# Altium project two_ax_PCB.PrjPcb (part 2 of 2)

## Sheet MotorCell.SchDoc
size A3; SheetNumber: 2
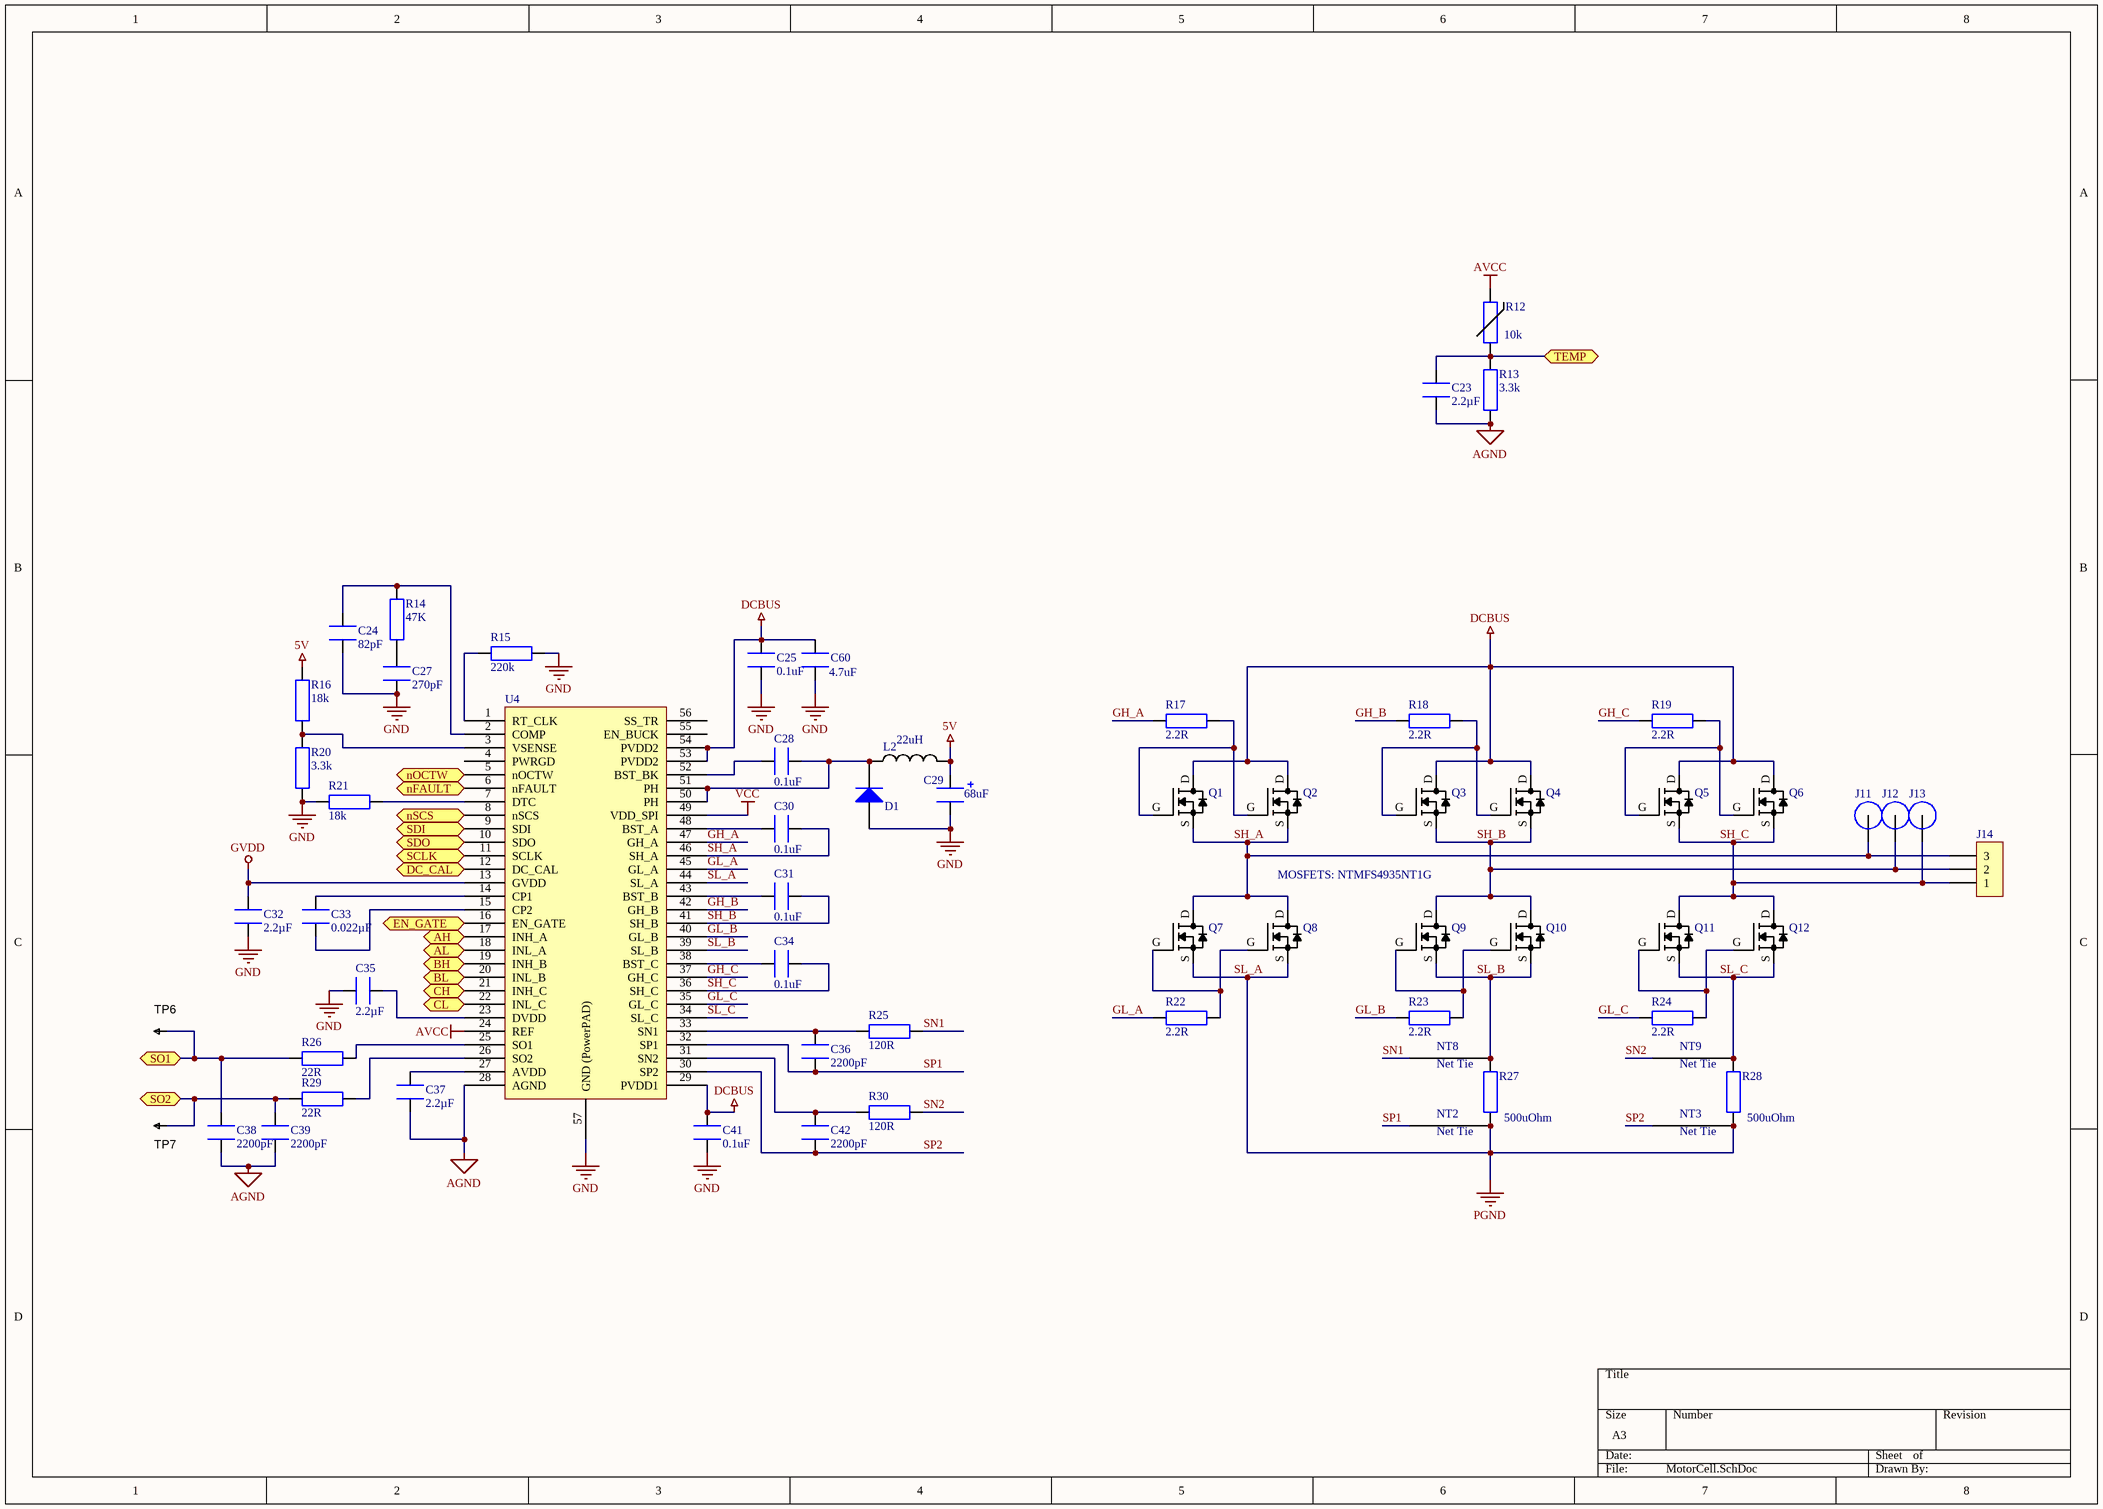
[diagram p1: MotorCell.SchDoc]

### Parts
C23  2.2µF  [CAPC1608X09L]
C24  82pF  [CAPC1608X09L]
C25  0.1uF  [CAPC1608X09L]
C27  270pF  [CAPC1608X09L]
C28  0.1uF  [CAPC1608X09L]
C29  68uF  [CAPCP6032X28N]
C30  0.1uF  [CAPC1608X09L]
C31  0.1uF  [CAPC1608X09L]
C32  2.2µF  [CAPC1608X09L]
C33  0.022µF  [CAPC1608X09L]
C34  0.1uF  [CAPC1608X09L]
C35  2.2µF  [CAPC1608X09L]
C36  2200pF  [CAPC1608X09L]
C37  2.2µF  [CAPC1608X09L]
C38  2200pF  [CAPC1608X09L]
C39  2200pF  [CAPC1608X09L]
C41  0.1uF  [CAPC1608X09L]
C42  2200pF  [CAPC1608X09L]
C60  4.7uF  [CAPC2012X09N]
D1  (no value)  [DIOM2717X10N]
J11  (no value)  [M3 Spade Hole]
J12  (no value)  [M3 Spade Hole]
J13  (no value)  [M3 Spade Hole]
J14  1704936  [1704936]  (value not drawn)
L2  22uH  [INDC6060X28N]
NT2  0.25mm  [NetTie_0.25mm]  (value not drawn)  (net tie, no BOM)
NT3  0.25mm  [NetTie_0.25mm]  (value not drawn)  (net tie, no BOM)
NT8  0.25mm  [NetTie_0.25mm]  (value not drawn)  (net tie, no BOM)
NT9  0.25mm  [NetTie_0.25mm]  (value not drawn)  (net tie, no BOM)
Q1  (no value)  [SO8FL]
Q2  FILL_FOOTPRINT  [SO8FL_FILL]  (value not drawn)
Q3  (no value)  [SO8FL]
Q4  FILL_FOOTPRINT  [SO8FL_FILL]  (value not drawn)
Q5  (no value)  [SO8FL]
Q6  FILL_FOOTPRINT  [SO8FL_FILL]  (value not drawn)
Q7  (no value)  [SO8FL]
Q8  (no value)  [SO8FL]
Q9  (no value)  [SO8FL]
Q10  (no value)  [SO8FL]
Q11  (no value)  [SO8FL]
Q12  (no value)  [SO8FL]
R12  10k  [RESC1005X40N]
R13  3.3k  [RESC1608X55N]
R14  47K  [RESC1608X55N]
R15  220k  [RESC1608X55N]
R16  18k  [RESC1608X55N]
R17  2.2R  [RESC1608X55N]
R18  2.2R  [RESC1608X55N]
R19  2.2R  [RESC1608X55N]
R20  3.3k  [RESC1608X55N]
R21  18k  [RESC1608X55N]
R22  2.2R  [RESC1608X55N]
R23  2.2R  [RESC1608X55N]
R24  2.2R  [RESC1608X55N]
R25  120R  [RESC1608X55N]
R26  22R  [RESC1608X55N]
R27  500uOhm  [RESC6432X09N]
R28  500uOhm  [RESC6432X09N]
R29  22R  [RESC1608X55N]
R30  120R  [RESC1608X55N]
TP6  TESTPOINT  [TP-R30]  (value not drawn)  (no BOM)
TP7  TESTPOINT  [TP-R30]  (value not drawn)  (no BOM)
U4  (no value)  [TSSOP50P810X120_HS-57N]

### Ports
AH, AL, BH, BL, CH, CL, DC_CAL, EN_GATE, nFAULT, nOCTW, nSCS, SCLK, SDI, SDO, SO1, SO2, TEMP

### Nets
5V: C29.1 L2.2 R16.1
AGND: C23.1 C37.1 C38.2 C39.2 R13.2 U4.28(AGND)
AVCC: R12.2 U4.24(REF)
DCBUS: C25.1 C41.1 C60.2 Q1.D Q2.D Q3.D Q4.D Q5.D Q6.D U4.29(PVDD1) U4.53(PVDD2) U4.54(PVDD2)
GND: C24.2 C25.2 C27.2 C29.2 C32.1 C35.1 C41.2 C60.1 D1.A R15.2 R20.2 R21.2 U4.57(GND_(PowerPAD))
GVDD: C32.2 U4.13(GVDD)
PGND: NT2.2 NT3.2 Q7.S Q8.S R27.1 R28.1 U4.44(SL_A)  [also labelled SL_A]
VCC: U4.49(VDD_SPI)
EN_GATE: U4.16(EN_GATE) ; port EN_GATE
GH_A: R17.2 U4.47(GH_A)  [project net GH_A_2]
GH_B: R18.2 U4.42(GH_B)  [project net GH_B_2]
GH_C: R19.2 U4.37(GH_C)  [project net GH_C_2]
GL_A: R22.2 U4.45(GL_A)  [project net GL_A_2]
GL_B: R23.2 U4.40(GL_B)  [project net GL_B_2]
GL_C: R24.2 U4.35(GL_C)  [project net GL_C_2]
M0_AH: U4.17(INH_A) ; port AH
M0_AL: U4.18(INL_A) ; port AL
M0_BH: U4.19(INH_B) ; port BH
M0_BL: U4.20(INL_B) ; port BL
M0_CH: U4.21(INH_C) ; port CH
M0_CL: U4.22(INL_C) ; port CL
M0_nCS: U4.8(nSCS) ; port nSCS
M0_SO1: C38.1 R26.2 TP6.1 ; port SO1
M0_SO2: C39.1 R29.2 TP7.1 ; port SO2
M0_TEMP: C23.2 R12.1 R13.1 ; port TEMP
nFAULT: U4.6(nFAULT) ; port nFAULT
SH_A: C30.1 J11.1 J14.3 Q1.S Q2.S Q7.D Q8.D U4.46(SH_A)  [project net SH_A_2]
SH_B: C31.1 J12.1 J14.2 Q3.S Q4.S Q9.D Q10.D U4.41(SH_B)  [project net SH_B_2]
SH_C: C34.1 J13.1 J14.1 Q5.S Q6.S Q11.D Q12.D U4.36(SH_C)  [project net SH_C_2]
SL_B: NT8.2 Q9.S Q10.S R27.2 U4.39(SL_B)  [project net SL_B_2]
SL_C: NT9.2 Q11.S Q12.S R28.2 U4.34(SL_C)  [project net SL_C_2]
SN1: NT8.1 R25.1  [project net SN1_2]
SN2: NT9.1 R30.1  [project net SN2_2]
SP1: C36.2 NT2.1 U4.32(SP1)  [project net SP1_2]
SP2: C42.2 NT3.1 U4.30(SP2)  [project net SP2_2]
SPI_MISO: U4.10(SDO) ; port SDO
SPI_MOSI: U4.9(SDI) ; port SDI
SPI_SCK: U4.11(SCLK) ; port SCLK
NetC24_1: C24.1 R14.1 U4.2(COMP)
NetC27_1: C27.1 R14.2
NetC28_1: C28.1 D1.K L2.1 U4.50(PH) U4.51(PH)
NetC28_2: C28.2 U4.52(BST_BK)
NetC30_2: C30.2 U4.48(BST_A)
NetC31_2: C31.2 U4.43(BST_B)
NetC33_1: C33.1 U4.14(CP1)
NetC33_2: C33.2 U4.15(CP2)
NetC34_2: C34.2 U4.38(BST_C)
NetC35_2: C35.2 U4.23(DVDD)
NetC36_1: C36.1 R25.2 U4.33(SN1)
NetC37_2: C37.2 U4.27(AVDD)
NetC42_1: C42.1 R30.2 U4.31(SN2)
NetQ1_G: Q1.G Q2.G R17.1
NetQ3_G: Q3.G Q4.G R18.1
NetQ5_G: Q5.G Q6.G R19.1
NetQ7_G: Q7.G Q8.G R22.1
NetQ9_G: Q9.G Q10.G R23.1
NetQ11_G: Q11.G Q12.G R24.1
NetR15_1: R15.1 U4.1(RT_CLK)
NetR16_2: R16.2 R20.1 U4.3(VSENSE)
NetR21_1: R21.1 U4.7(DTC)
NetR26_1: R26.1 U4.25(SO1)
NetR29_1: R29.1 U4.26(SO2)
NetU4_5: U4.5(nOCTW) ; port nOCTW
NetU4_12: U4.12(DC_CAL) ; port DC_CAL

Not connected (* = marked no-connect by the designer): U4 4(PWRGD) 55(EN_BUCK) 56(SS_TR)

### Notes on the sheet
- MOSFETS: NTMFS4935NT1G
- (in symbol NetTie_0.25mm) Net Tie

### Library data of the parts
C23 C32 C35 C37 = GRM188R61C225KE15D: CAP CER 2.2UF 16V X5R 0603; Manufacturer: Murata Electronics North America; Tolerance: ±10%; Supplier 1: Digi-Key; Supplier Part Number 1: 490-3296-1-ND; Manufacturer Part Number: GRM188R61C225KE15D; RoHS: RoHS Compliant; Category: Capacitors; Stock 1: 1255740; Pricing 1: 1=0.12, 10=0.08, 50=0.046, 100=0.038, 250=0.032, 500=0.0268, 1000=0.022 (USD); Packaging: Cut Tape (CT); Capacitance: 2.2µF; Voltage - Rated: 16V; Temperature Coefficient: X5R; Mounting Type: Surface Mount, MLCC; Operating Temperature: -55°C ~ 85°C; Applications: General Purpose; Ratings: -; Package / Case: 0603 (1608 Metric); Size / Dimension: 0.063" L x 0.031" W (1.60mm x 0.80mm); Height - Seated (Max): -; Thickness (Max): 0.035" (0.90mm); Lead Spacing: -; Features: -; Lead Style: -; ComponentLink1URL: http://www.murata.com/~/media/webrenewal/support/library/catalog/products/capacitor/mlcc/c02e.pdf; ComponentLink1Description: http://www.murata.com/~/media/webrenewal/support/library/catalog/products/capacitor/mlcc/c02e.pdf
C24 = GRM1885C2A820JA01D: CAP CER 82PF 100V NP0 0603; Manufacturer: Murata Electronics North America; Tolerance: ±5%; Temperature Coefficient: C0G, NP0; Supplier 1: Digi-Key; Supplier Part Number 1: 490-1349-1-ND; Manufacturer Part Number: GRM1885C2A820JA01D; RoHS: RoHS Compliant; Category: Capacitors; Stock 1: 58970; Pricing 1: 1=0.1, 10=0.052, 50=0.028, 100=0.0237, 250=0.01936, 500=0.01656, 1000=0.0129 (USD); Packaging: Cut Tape (CT); Capacitance: 82pF; Voltage - Rated: 100V; Mounting Type: Surface Mount, MLCC; Operating Temperature: -55°C ~ 125°C; Applications: General Purpose; Ratings: -; Package / Case: 0603 (1608 Metric); Size / Dimension: 0.063" L x 0.031" W (1.60mm x 0.80mm); Height - Seated (Max): -; Thickness (Max): 0.035" (0.90mm); Lead Spacing: -; Features: -; Lead Style: -; ComponentLink1URL: http://www.murata.com/~/media/webrenewal/support/library/catalog/products/capacitor/mlcc/c02e.pdf; ComponentLink1Description: http://www.murata.com/~/media/webrenewal/support/library/catalog/products/capacitor/mlcc/c02e.pdf
C25 C28 C30 C31 C34 C41 = GRM188R71H104KA93D: CAP CER 0.1UF 50V X7R 0603; Manufacturer: Murata Electronics North America; Tolerance: ±10%; Supplier 1: Digi-Key; Supplier Part Number 1: 490-1519-2-ND; Manufacturer Part Number: GRM188R71H104KA93D; RoHS: RoHS Compliant; Category: Capacitors; Pricing 1: 4000=0.01822, 8000=0.01663, 12000=0.01584 (USD); Packaging: Tape & Reel (TR); Capacitance: 0.1uF; Voltage - Rated: 50V; Temperature Coefficient: X7R; Mounting Type: Surface Mount, MLCC; Operating Temperature: -55°C ~ 125°C; Applications: General Purpose; Ratings: -; Package / Case: 0603 (1608 Metric); Size / Dimension: 0.063" L x 0.032" W (1.60mm x 0.80mm); Height - Seated (Max): -; Thickness (Max): 0.035" (0.90mm); Lead Spacing: -; Features: -; Lead Style: -; ComponentLink1URL: http://www.murata.com/~/media/webrenewal/support/library/catalog/products/capacitor/mlcc/c02e.ashx?la=en-us; ComponentLink1Description: http://www.murata.com/~/media/webrenewal/support/library/catalog/products/capacitor/mlcc/c02e.ashx?la=en-us; Stock: 19812000; Part Status: Active; Supplier 2: Digi-Key; Supplier Part Number 2: 490-1519-1-ND; Pricing 2: 1=0.12, 10=0.084, 100=0.0396, 500=0.02778, 1000=0.023 (USD)
C27 = GRM1885C1H271JA01D: CAP CER 270PF 50V NP0 0603; Manufacturer: Murata Electronics North America; Tolerance: ±5%; Temperature Coefficient: C0G, NP0; Supplier 1: Digi-Key; Supplier Part Number 1: 490-1437-1-ND; Manufacturer Part Number: GRM1885C1H271JA01D; RoHS: RoHS Compliant; Category: Capacitors; Stock 1: 46048; Pricing 1: 1=0.1, 10=0.048, 50=0.026, 100=0.022, 250=0.018, 500=0.0154, 1000=0.012 (USD); Packaging: Cut Tape (CT); Capacitance: 270pF; Voltage - Rated: 50V; Mounting Type: Surface Mount, MLCC; Operating Temperature: -55°C ~ 125°C; Applications: General Purpose; Ratings: -; Package / Case: 0603 (1608 Metric); Size / Dimension: 0.063" L x 0.031" W (1.60mm x 0.80mm); Height - Seated (Max): -; Thickness (Max): 0.035" (0.90mm); Lead Spacing: -; Features: -; Lead Style: -; ComponentLink1URL: http://www.murata.com/~/media/webrenewal/support/library/catalog/products/capacitor/mlcc/c02e.pdf; ComponentLink1Description: http://www.murata.com/~/media/webrenewal/support/library/catalog/products/capacitor/mlcc/c02e.pdf
C29 = T495C686M016ATE250: CAP TANT 68UF 16V 20% 2312 250mOhm; Manufacturer: KEMET; Manufacturer Size Code: C; Type: Molded; Lifetime @ Temp.: 2000 Hrs @ 85°C; Value: 68uF; Supplier 1: Digi-Key; Supplier Part Number 1: 399-10452-1-ND; RoHS: RoHS Compliant; Category: Capacitors; Stock: 39507; Pricing 1: 1=0.98, 10=0.747, 100=0.5345 (USD); Packaging: Cut Tape (CT); Part Status: Active; Tolerance: ±20%; ESR (Equivalent Series Resistance): 250 mOhm; Operating Temperature: -55°C ~ 125°C; Mounting Type: Surface Mount; Package / Case: 2312 (6032 Metric); Size / Dimension: 0.236" L x 0.126" W (6.00mm x 3.20mm); Height - Seated (Max): 0.110" (2.80mm); Lead Spacing: -; Features: General Purpose; Failure Rate: -; ComponentLink1URL: https://search.kemet.com/component-edge/download/datasheet/T495C686M016ATE250.pdf; ComponentLink1Description: https://search.kemet.com/component-edge/download/datasheet/T495C686M016ATE250.pdf; Supplier 2: Digi-Key; Supplier Part Number 2: 399-10452-2-ND; Pricing 2: 500=0.35986, 1000=0.30988, 2500=0.28988, 5000=0.27608 (USD); Manufacturer Part Number: T495C686M016ATE250
C33 = GRM188R71H223KA01D: CAP CER 0.022UF 50V X7R 0603; Manufacturer: Murata Electronics North America; Tolerance: ±10%; Supplier 1: Digi-Key; Supplier Part Number 1: 490-1517-2-ND; Manufacturer Part Number: GRM188R71H223KA01D; RoHS: RoHS Compliant; Category: Capacitors; Pricing 1: 4000=0.01518, 8000=0.01386, 12000=0.0132 (USD); Packaging: Tape & Reel (TR); Capacitance: 0.022µF; Voltage - Rated: 50V; Temperature Coefficient: X7R; Mounting Type: Surface Mount, MLCC; Operating Temperature: -55°C ~ 125°C; Applications: General Purpose; Ratings: -; Package / Case: 0603 (1608 Metric); Size / Dimension: 0.063" L x 0.032" W (1.60mm x 0.80mm); Height - Seated (Max): -; Thickness (Max): 0.035" (0.90mm); Lead Spacing: -; Features: -; Lead Style: -; ComponentLink1URL: http://search.murata.co.jp/Ceramy/image/img/A01X/G101/ENG/GRM188R71H223KA01-01.pdf; ComponentLink1Description: http://search.murata.co.jp/Ceramy/image/img/A01X/G101/ENG/GRM188R71H223KA01-01.pdf; Stock: 608000; Part Status: Active; Supplier 2: Digi-Key; Supplier Part Number 2: 490-1517-1-ND; Pricing 2: 1=0.11, 10=0.083, 100=0.0372, 500=0.02656, 1000=0.02087 (USD)
C36 C38 C39 C42 = GRM1885C1H222JA01D: CAP CER 2200PF 50V NP0 0603; Manufacturer: Murata Electronics North America; Tolerance: ±5%; Temperature Coefficient: C0G, NP0; Supplier 1: Digi-Key; Supplier Part Number 1: 490-1459-1-ND; RoHS: RoHS Compliant; Category: Capacitors; Stock 1: 850589; Pricing 1: 1=0.11, 10=0.08, 25=0.058, 50=0.0434, 100=0.0355, 250=0.02972, 500=0.02536, 1000=0.01992 (USD); Packaging: Cut Tape (CT); Capacitance: 2200pF; Voltage - Rated: 50V; Mounting Type: Surface Mount, MLCC; Operating Temperature: -55°C ~ 125°C; Applications: General Purpose; Ratings: -; Package / Case: 0603 (1608 Metric); Size / Dimension: 0.063" L x 0.031" W (1.60mm x 0.80mm); Height - Seated (Max): -; Thickness (Max): 0.035" (0.90mm); Lead Spacing: -; Features: -; Lead Style: -; ComponentLink1URL: http://www.murata.com/~/media/webrenewal/support/library/catalog/products/capacitor/mlcc/c02e.ashx; ComponentLink1Description: http://www.murata.com/~/media/webrenewal/support/library/catalog/products/capacitor/mlcc/c02e.ashx; Part Status: Active
C60 = GRM219R6YA475KA73D: CAP CER 4.7UF 35V X5R 0805; Manufacturer: Murata Electronics North America; Tolerance: ±10%; Supplier 1: Digi-Key; Supplier Part Number 1: 490-7208-2-ND; RoHS: RoHS Compliant; Category: Capacitors; Pricing 1: 4000=0.05126, 8000=0.0487, 12000=0.04613 (USD); Packaging: Tape & Reel (TR); Part Status: Active; Voltage - Rated: 35V; Temperature Coefficient: X5R; Operating Temperature: -55°C ~ 85°C; Features: Derating Recommended; Ratings: -; Applications: General Purpose; Mounting Type: Surface Mount, MLCC; Package / Case: 0805 (2012 Metric); Size / Dimension: 0.079" L x 0.049" W (2.01mm x 1.25mm); Height - Seated (Max): -; Thickness (Max): 0.037" (0.95mm); Lead Spacing: -; Lead Style: -; ComponentLink1URL: http://www.murata.com/~/media/webrenewal/support/library/catalog/products/capacitor/mlcc/c02e.ashx?la=en-us; ComponentLink1Description: http://www.murata.com/~/media/webrenewal/support/library/catalog/products/capacitor/mlcc/c02e.ashx?la=en-us; Supplier 2: Digi-Key; Supplier Part Number 2: 490-7208-1-ND; Pricing 2: 1=0.26, 10=0.177, 100=0.1002, 500=0.07076, 1000=0.06191 (USD); Value: 4.7uF; Stock: 152000; Manufacturer Part Number: GRM219R6YA475KA73D
D1 = MBR140SFT1G: Rectifier Diode, Single, 40 V, 1 A, SOD-123FL, 2, 550 mV
J11-J13 = M3 Spade Terminal
J14 = 1704936: CONN TERM BLOCK 3POS 7.62MM; Manufacturer: Phoenix Contact; Number of Levels: 1; Positions Per Level: 3; Pitch: 0.300" (7.62mm); Mating Orientation: Horizontal with Board; Current: 30A; Voltage: 300V; Wire Gauge: 10-30 AWG; Wire Termination: Screw - Rising Cage Clamp; Torque - Screw: 0.5-0.6 Nm (4.4-5.3 Lb-In); Screw Thread: M3; Supplier 1: Digi-Key; Supplier Part Number 1: 277-5954-ND; RoHS: RoHS Compliant; Category: Connectors, Interconnects; Stock: 3559; Pricing 1: 1=2.19, 10=2.128, 50=1.989, 100=1.8299, 250=1.69064, 500=1.61108, 1000=1.482 (USD); Packaging: Bulk; Part Status: Active; Mounting Type: Through Hole; Features: Interlocking (Side); Color: Green; Operating Temperature: -; Housing Material: Polyamide (PA), Nylon; Contact Material - Plating: -; Clamp Material - Plating: -; Screw Material - Plating: -; ComponentLink1URL: http://media.digikey.com/PDF/Data%20Sheets/Phoenix%20Contact%20PDFs/1704936.pdf; ComponentLink1Description: http://media.digikey.com/PDF/Data%20Sheets/Phoenix%20Contact%20PDFs/1704936.pdf; Manufacturer Part Number: 1704936
L2 = NR6028T220M: INDUCTOR 22UH 1.4A 175.5 MOHM; Value: 22uH
NT2 NT3 NT8 NT9 = NetTie_0.25mm
Q1-Q12 = NTMFS4935NT1G: MOSFET N-CH 30V 13A SO8FL; Manufacturer: ON Semiconductor; FET Type: N-Channel; Current - Continuous Drain (Id) @ 25°C: 13A (Ta), 93A (Tc); Drive Voltage (Max Rds On,  Min Rds On): 4.5V, 10V; Vgs(th) (Max) @ Id: 2.2V @ 250µA; Gate Charge (Qg) (Max) @ Vgs: 49.4nC @ 10V; Input Capacitance (Ciss) (Max) @ Vds: 4850pF @ 15V; Vgs (Max): ±20V; Power Dissipation (Max): 930mW (Ta), 48W (Tc); Rds On (Max) @ Id, Vgs: 3.2 mOhm @ 30A, 10V; Supplier 1: Digi-Key; Supplier Part Number 1: NTMFS4935NT1GOSCT-ND; RoHS: RoHS Compliant; Category: Discrete Semiconductor Products; Stock 1: 932; Pricing 1: 1=0.61, 10=0.541, 100=0.4145, 500=0.3277 (USD); Packaging: Cut Tape (CT); Part Status: Active; Technology: MOSFET (Metal Oxide); Drain to Source Voltage (Vdss): 30V; FET Feature: -; Operating Temperature: -55°C ~ 150°C (TJ); Mounting Type: Surface Mount; Supplier Device Package: 5-DFN (5x6) (8-SOFL); Package / Case: 8-PowerTDFN, 5 Leads; ComponentLink1URL: http://www.onsemi.com/pub_link/Collateral/NTMFS4935N-D.PDF; ComponentLink1Description: http://www.onsemi.com/pub_link/Collateral/NTMFS4935N-D.PDF; Manufacturer Part Number: NTMFS4935NT1G
R12 = NCP15XH103F03RC: THERMISTOR 10K OHM NTC 0402 SMD; Value: 10k
R13 R20 = RC0603FR-073K3L: RES SMD 3.3K OHM 1% 1/10W 0603; Manufacturer: Yageo; Power (Watts): 0.1W, 1/10W; Temperature Coefficient: ±100ppm/°C; Supplier 1: Digi-Key; Supplier Part Number 1: 311-3.30KHRCT-ND; Manufacturer Part Number: RC0603FR-073K3L; RoHS: RoHS Compliant; Category: Resistors; Stock 1: 420019; Pricing 1: 1=0.1, 10=0.014, 25=0.01, 100=0.0057, 250=0.00436, 500=0.00348, 1000=0.00257, 2500=0.00223 (USD); Packaging: Cut Tape (CT); Resistance (Ohms): 3.3k; Tolerance: ±1%; Composition: Thick Film; Features: Moisture Resistant; Operating Temperature: -55°C ~ 155°C; Package / Case: 0603 (1608 Metric); Supplier Device Package: 0603; Size / Dimension: 0.063" L x 0.031" W (1.60mm x 0.80mm); Height: 0.022" (0.55mm); Number of Terminations: 2; ComponentLink1URL: http://www.yageo.com/documents/recent/PYu-RC_Group_51_RoHS_L_04.pdf; ComponentLink1Description: http://www.yageo.com/documents/recent/PYu-RC_Group_51_RoHS_L_04.pdf
R14 = RC0603FR-0747KL: RES SMD 47K OHM 1% 1/10W 0603; Manufacturer: Yageo; Power (Watts): 0.1W, 1/10W; Temperature Coefficient: ±100ppm/°C; Supplier 1: Digi-Key; Supplier Part Number 1: 311-47.0KHRCT-ND; Manufacturer Part Number: RC0603FR-0747KL; RoHS: RoHS Compliant; Category: Resistors; Stock 1: 930868; Pricing 1: 1=0.1, 10=0.014, 25=0.01, 100=0.0057, 250=0.00436, 500=0.00348, 1000=0.00257, 2500=0.00223 (USD); Packaging: Cut Tape (CT); Resistance (Ohms): 47k; Tolerance: ±1%; Composition: Thick Film; Features: Moisture Resistant; Operating Temperature: -55°C ~ 155°C; Package / Case: 0603 (1608 Metric); Supplier Device Package: 0603; Size / Dimension: 0.063" L x 0.031" W (1.60mm x 0.80mm); Height: 0.022" (0.55mm); Number of Terminations: 2; ComponentLink1URL: http://www.yageo.com/documents/recent/PYu-RC_Group_51_RoHS_L_04.pdf; ComponentLink1Description: http://www.yageo.com/documents/recent/PYu-RC_Group_51_RoHS_L_04.pdf
R15 = RC0603FR-07220KL: RES SMD 220K OHM 1% 1/10W 0603; Manufacturer: Yageo; Power (Watts): 0.1W, 1/10W; Temperature Coefficient: ±100ppm/°C; Supplier 1: Digi-Key; Supplier Part Number 1: 311-220KHRCT-ND; Manufacturer Part Number: RC0603FR-07220KL; RoHS: RoHS Compliant; Category: Resistors; Stock 1: 204390; Pricing 1: 1=0.1, 10=0.014, 25=0.01, 100=0.0057, 250=0.00436, 500=0.00348, 1000=0.00257, 2500=0.00223 (USD); Packaging: Cut Tape (CT); Resistance (Ohms): 220k; Tolerance: ±1%; Composition: Thick Film; Features: Moisture Resistant; Operating Temperature: -55°C ~ 155°C; Package / Case: 0603 (1608 Metric); Supplier Device Package: 0603; Size / Dimension: 0.063" L x 0.031" W (1.60mm x 0.80mm); Height: 0.022" (0.55mm); Number of Terminations: 2; ComponentLink1URL: http://www.yageo.com/documents/recent/PYu-RC_Group_51_RoHS_L_04.pdf; ComponentLink1Description: http://www.yageo.com/documents/recent/PYu-RC_Group_51_RoHS_L_04.pdf
R16 R21 = RC0603FR-0718KL: RES SMD 18K OHM 1% 1/10W 0603; Manufacturer: Yageo; Power (Watts): 0.1W, 1/10W; Temperature Coefficient: ±100ppm/°C; Supplier 1: Digi-Key; Supplier Part Number 1: 311-18.0KHRCT-ND; Manufacturer Part Number: RC0603FR-0718KL; RoHS: RoHS Compliant; Category: Resistors; Stock 1: 0; Pricing 1: 1=0.1, 10=0.014, 25=0.01, 100=0.0057, 250=0.00436, 500=0.00348, 1000=0.00257, 2500=0.00223 (USD); Packaging: Cut Tape (CT); Resistance (Ohms): 18k; Tolerance: ±1%; Composition: Thick Film; Features: Moisture Resistant; Operating Temperature: -55°C ~ 155°C; Package / Case: 0603 (1608 Metric); Supplier Device Package: 0603; Size / Dimension: 0.063" L x 0.031" W (1.60mm x 0.80mm); Height: 0.022" (0.55mm); Number of Terminations: 2; ComponentLink1URL: http://www.yageo.com/documents/recent/PYu-RC_Group_51_RoHS_L_04.pdf; ComponentLink1Description: http://www.yageo.com/documents/recent/PYu-RC_Group_51_RoHS_L_04.pdf
R17-R19 R22-R24 = RC0603FR-072R2L: RES SMD 2.2 OHM 1% 1/10W 0603; Manufacturer: Yageo; Resistance (Ohms): 2.2; Power (Watts): 0.1W, 1/10W; Temperature Coefficient: ±200ppm/°C; Supplier 1: Digi-Key; Supplier Part Number 1: 311-2.2HRCT-ND; Manufacturer Part Number: RC0603FR-072R2L; RoHS: RoHS Compliant; Category: Resistors; Stock 1: 16531; Pricing 1: 1=0.1, 10=0.02, 25=0.0144, 100=0.0082, 250=0.00624, 500=0.00498, 1000=0.00367, 2500=0.00319 (USD); Packaging: Cut Tape (CT); Tolerance: ±1%; Composition: Thick Film; Features: Moisture Resistant; Operating Temperature: -55°C ~ 155°C; Package / Case: 0603 (1608 Metric); Supplier Device Package: 0603; Size / Dimension: 0.063" L x 0.031" W (1.60mm x 0.80mm); Height: 0.022" (0.55mm); Number of Terminations: 2; ComponentLink1URL: http://www.yageo.com/documents/recent/PYu-RC_Group_51_RoHS_L_04.pdf; ComponentLink1Description: http://www.yageo.com/documents/recent/PYu-RC_Group_51_RoHS_L_04.pdf
R25 R30 = RC0603FR-07120RL: RES SMD 120 OHM 1% 1/10W 0603; Manufacturer: Yageo; Resistance (Ohms): 120; Power (Watts): 0.1W, 1/10W; Temperature Coefficient: ±100ppm/°C; Supplier 1: Digi-Key; Supplier Part Number 1: 311-120HRCT-ND; Manufacturer Part Number: RC0603FR-07120RL; RoHS: RoHS Compliant; Category: Resistors; Stock 1: 1545282; Pricing 1: 1=0.1, 10=0.014, 25=0.01, 100=0.0057, 250=0.00436, 500=0.00348, 1000=0.00257, 2500=0.00223 (USD); Packaging: Cut Tape (CT); Tolerance: ±1%; Composition: Thick Film; Features: Moisture Resistant; Operating Temperature: -55°C ~ 155°C; Package / Case: 0603 (1608 Metric); Supplier Device Package: 0603; Size / Dimension: 0.063" L x 0.031" W (1.60mm x 0.80mm); Height: 0.022" (0.55mm); Number of Terminations: 2; ComponentLink1URL: http://www.yageo.com/documents/recent/PYu-RC_Group_51_RoHS_L_04.pdf; ComponentLink1Description: http://www.yageo.com/documents/recent/PYu-RC_Group_51_RoHS_L_04.pdf
R26 R29 = RC0603FR-0722RL: RES SMD 22 OHM 1% 1/10W 0603; Manufacturer: Yageo; Resistance (Ohms): 22; Power (Watts): 0.1W, 1/10W; Temperature Coefficient: ±100ppm/°C; Supplier 1: Digi-Key; Supplier Part Number 1: 311-22.0HRCT-ND; Manufacturer Part Number: RC0603FR-0722RL; RoHS: RoHS Compliant; Category: Resistors; Stock 1: 575303; Pricing 1: 1=0.1, 10=0.014, 25=0.01, 100=0.0057, 250=0.00436, 500=0.00348, 1000=0.00257, 2500=0.00223 (USD); Packaging: Cut Tape (CT); Tolerance: ±1%; Composition: Thick Film; Features: Moisture Resistant; Operating Temperature: -55°C ~ 155°C; Package / Case: 0603 (1608 Metric); Supplier Device Package: 0603; Size / Dimension: 0.063" L x 0.031" W (1.60mm x 0.80mm); Height: 0.022" (0.55mm); Number of Terminations: 2; ComponentLink1URL: http://www.yageo.com/documents/recent/PYu-RC_Group_51_RoHS_L_04.pdf; ComponentLink1Description: http://www.yageo.com/documents/recent/PYu-RC_Group_51_RoHS_L_04.pdf
R27 R28 = CSR2512C0R0005F: RES SMD 0.0005 OHM 1% 3W 2512; Manufacturer: Riedon; Temperature Coefficient: ±100ppm/°C; Value: 500uOhm; Supplier 1: Digi-Key; Supplier Part Number 1: 696-1183-2-ND; RoHS: RoHS Compliant; Category: Resistors; Stock: 2000; Pricing 1: 2000=0.19817, 6000=0.1937, 10000=0.187, 50000=0.18148 (USD); Packaging: Tape & Reel (TR); Part Status: Active; Tolerance: ±1%; Power (Watts): 3W; Composition: Metal Element; Features: Current Sense; Operating Temperature: -55°C ~ 170°C; Package / Case: 2512 (6432 Metric); Supplier Device Package: 2512; Size / Dimension: 0.250" L x 0.118" W (6.35mm x 3.00mm); Height - Seated (Max): 0.057" (1.45mm); Failure Rate: -; ComponentLink1URL: http://riedon.com/media/pdf/CSR.pdf; ComponentLink1Description: http://riedon.com/media/pdf/CSR.pdf; Supplier 2: Digi-Key; Supplier Part Number 2: 696-1183-1-ND; Pricing 2: 1=0.69, 10=0.574, 25=0.4916, 50=0.4426, 100=0.3852, 250=0.3442, 500=0.27864, 1000=0.22536 (USD); Manufacturer Part Number: CSR2512C0R0005F
TP6 TP7 = TESTPOINT: SMD test pin
U4 = DRV8301: MOTOR DRIVER, 3PH, 56HTSSOP

## Sheet MotorCell_noPow.SchDoc
size A3; SheetNumber: 3
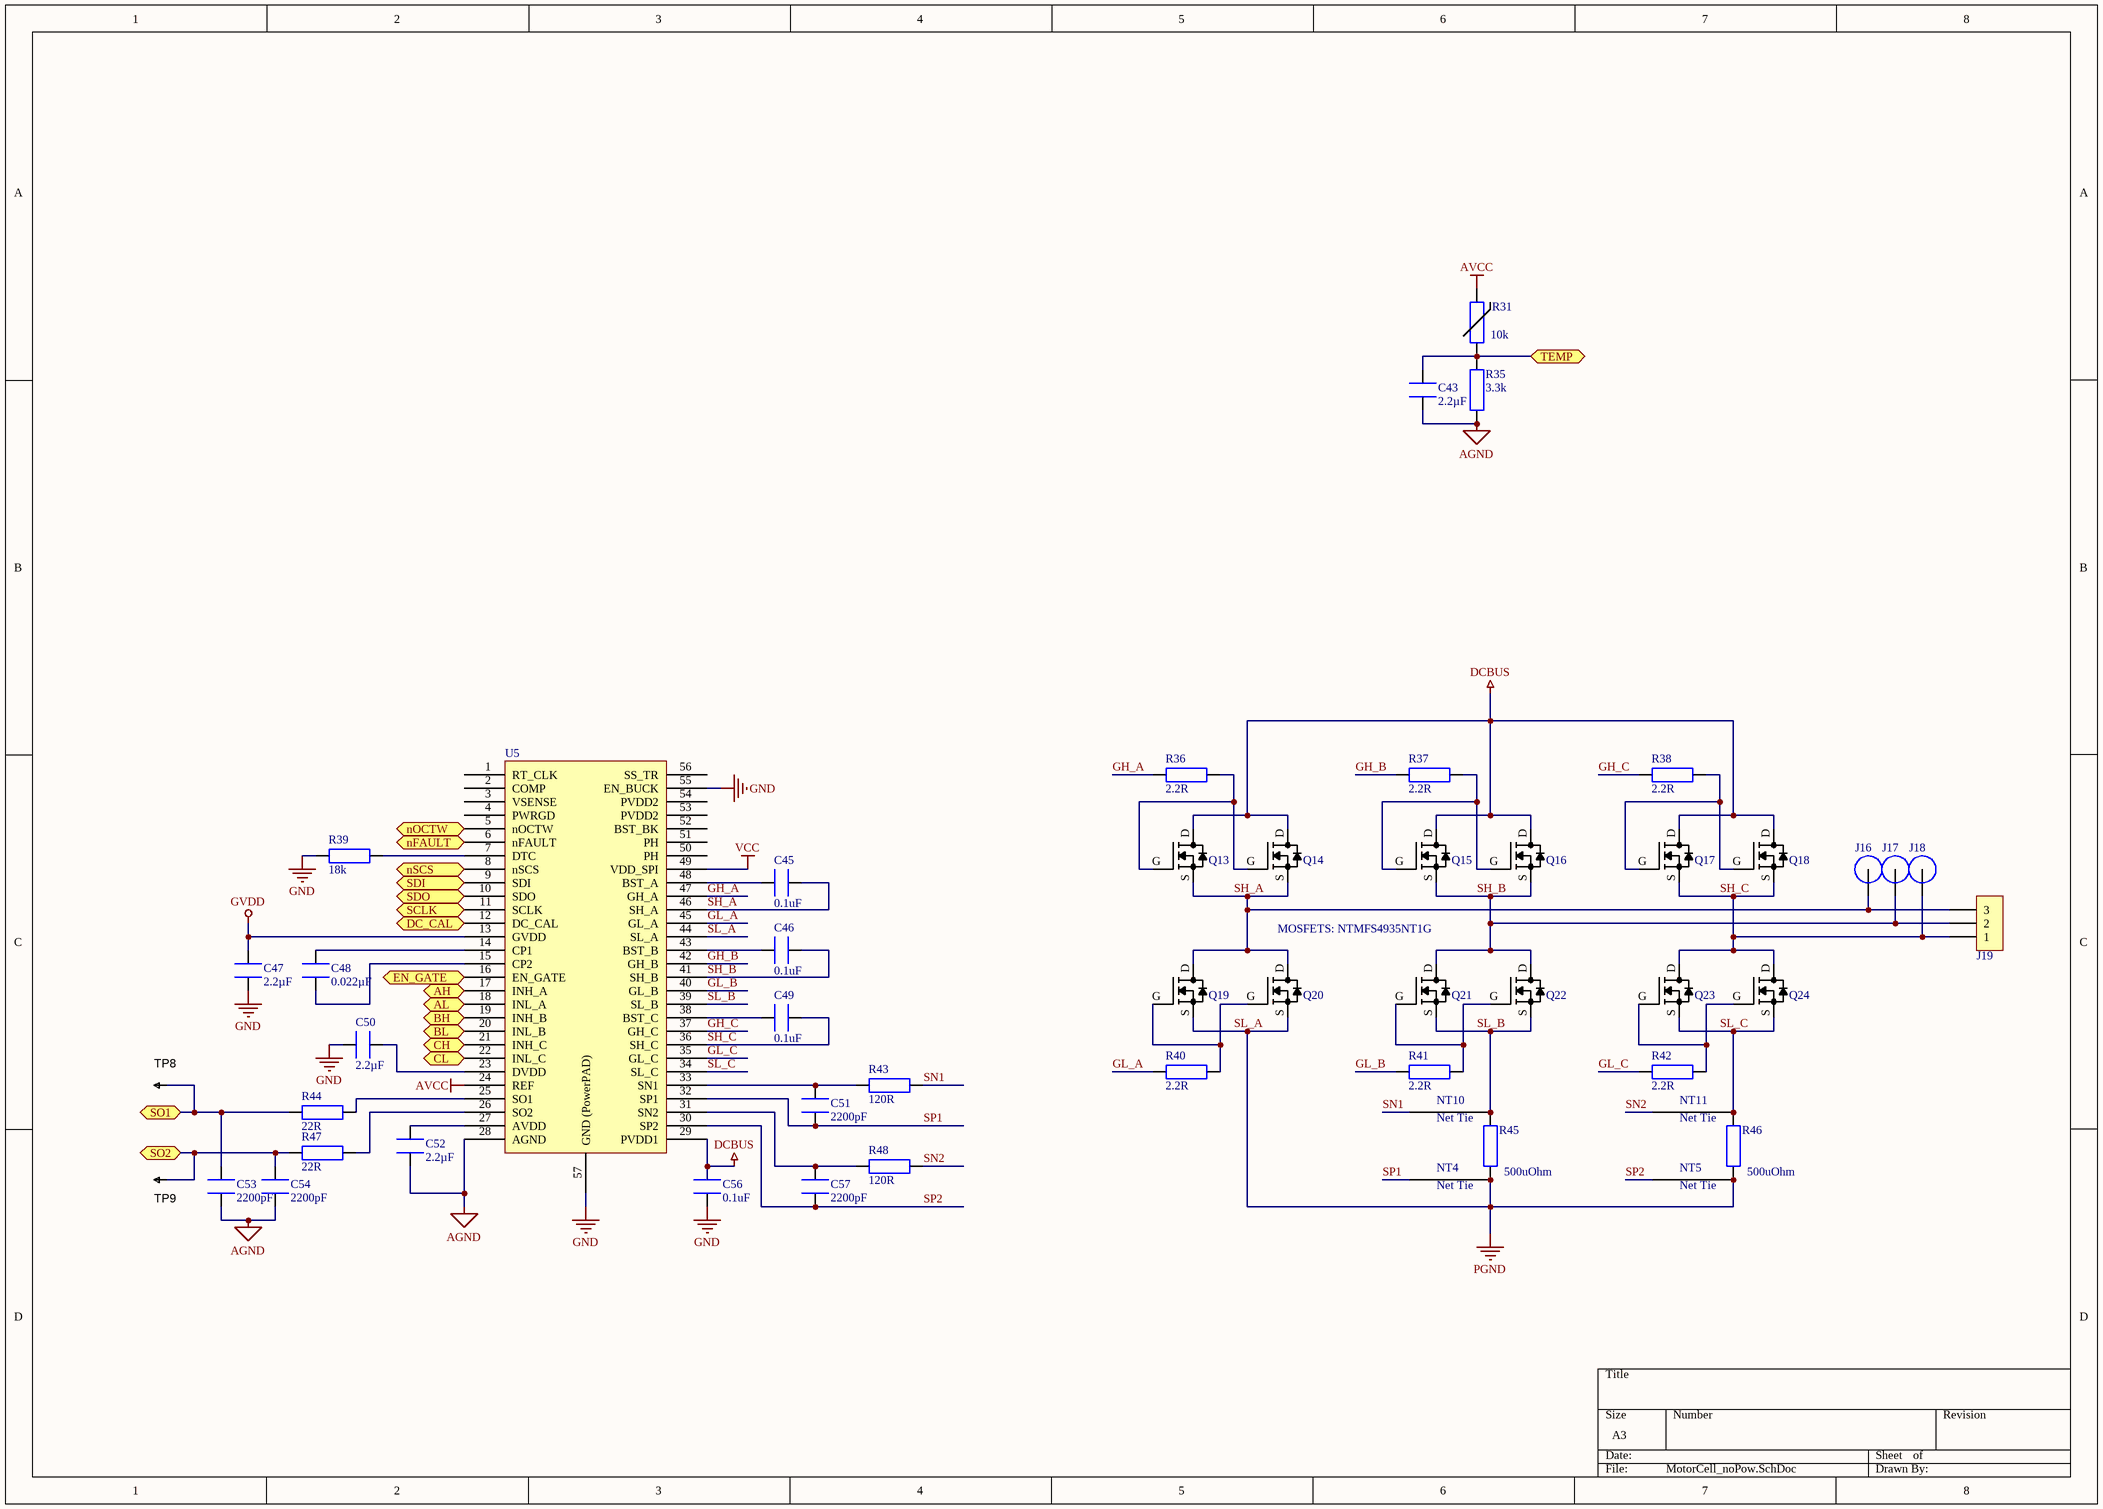
[diagram p2: MotorCell_noPow.SchDoc]

### Parts
C43  2.2µF  [CAPC1608X09L]
C45  0.1uF  [CAPC1608X09L]
C46  0.1uF  [CAPC1608X09L]
C47  2.2µF  [CAPC1608X09L]
C48  0.022µF  [CAPC1608X09L]
C49  0.1uF  [CAPC1608X09L]
C50  2.2µF  [CAPC1608X09L]
C51  2200pF  [CAPC1608X09L]
C52  2.2µF  [CAPC1608X09L]
C53  2200pF  [CAPC1608X09L]
C54  2200pF  [CAPC1608X09L]
C56  0.1uF  [CAPC1608X09L]
C57  2200pF  [CAPC1608X09L]
J16  (no value)  [M3 Spade Hole]
J17  (no value)  [M3 Spade Hole]
J18  (no value)  [M3 Spade Hole]
J19  1704936  [1704936]  (value not drawn)
NT4  0.25mm  [NetTie_0.25mm]  (value not drawn)  (net tie, no BOM)
NT5  0.25mm  [NetTie_0.25mm]  (value not drawn)  (net tie, no BOM)
NT10  0.25mm  [NetTie_0.25mm]  (value not drawn)  (net tie, no BOM)
NT11  0.25mm  [NetTie_0.25mm]  (value not drawn)  (net tie, no BOM)
Q13  (no value)  [SO8FL]
Q14  FILL_FOOTPRINT  [SO8FL_FILL]  (value not drawn)
Q15  (no value)  [SO8FL]
Q16  FILL_FOOTPRINT  [SO8FL_FILL]  (value not drawn)
Q17  (no value)  [SO8FL]
Q18  FILL_FOOTPRINT  [SO8FL_FILL]  (value not drawn)
Q19  (no value)  [SO8FL]
Q20  (no value)  [SO8FL]
Q21  (no value)  [SO8FL]
Q22  (no value)  [SO8FL]
Q23  (no value)  [SO8FL]
Q24  (no value)  [SO8FL]
R31  10k  [RESC1005X40N]
R35  3.3k  [RESC1608X55N]
R36  2.2R  [RESC1608X55N]
R37  2.2R  [RESC1608X55N]
R38  2.2R  [RESC1608X55N]
R39  18k  [RESC1608X55N]
R40  2.2R  [RESC1608X55N]
R41  2.2R  [RESC1608X55N]
R42  2.2R  [RESC1608X55N]
R43  120R  [RESC1608X55N]
R44  22R  [RESC1608X55N]
R45  500uOhm  [RESC6432X09N]
R46  500uOhm  [RESC6432X09N]
R47  22R  [RESC1608X55N]
R48  120R  [RESC1608X55N]
TP8  TESTPOINT  [TP-R30]  (value not drawn)  (no BOM)
TP9  TESTPOINT  [TP-R30]  (value not drawn)  (no BOM)
U5  (no value)  [TSSOP50P810X120_HS-57N]

### Ports
AH, AL, BH, BL, CH, CL, DC_CAL, EN_GATE, nFAULT, nOCTW, nSCS, SCLK, SDI, SDO, SO1, SO2, TEMP

### Nets
AGND: C43.1 C52.1 C53.2 C54.2 R35.2 U5.28(AGND)
AVCC: R31.2 U5.24(REF)
DCBUS: C56.1 Q13.D Q14.D Q15.D Q16.D Q17.D Q18.D U5.29(PVDD1)
GND: C47.1 C50.1 C56.2 R39.2 U5.55(EN_BUCK) U5.57(GND_(PowerPAD))
GVDD: C47.2 U5.13(GVDD)
PGND: NT4.2 NT5.2 Q19.S Q20.S R45.1 R46.1 U5.44(SL_A)  [also labelled SL_A]
VCC: U5.49(VDD_SPI)
EN_GATE: U5.16(EN_GATE) ; port EN_GATE
GH_A: R36.1 U5.47(GH_A)  [project net GH_A_3]
GH_B: R37.1 U5.42(GH_B)  [project net GH_B_3]
GH_C: R38.1 U5.37(GH_C)  [project net GH_C_3]
GL_A: R40.1 U5.45(GL_A)  [project net GL_A_3]
GL_B: R41.1 U5.40(GL_B)  [project net GL_B_3]
GL_C: R42.1 U5.35(GL_C)  [project net GL_C_3]
M1_AH: U5.17(INH_A) ; port AH
M1_AL: U5.18(INL_A) ; port AL
M1_BH: U5.19(INH_B) ; port BH
M1_BL: U5.20(INL_B) ; port BL
M1_CH: U5.21(INH_C) ; port CH
M1_CL: U5.22(INL_C) ; port CL
M1_nCS: U5.8(nSCS) ; port nSCS
M1_SO1: C53.1 R44.2 TP8.1 ; port SO1
M1_SO2: C54.1 R47.2 TP9.1 ; port SO2
M1_TEMP: C43.2 R31.1 R35.1 ; port TEMP
nFAULT: U5.6(nFAULT) ; port nFAULT
SH_A: C45.1 J16.1 J19.3 Q13.S Q14.S Q19.D Q20.D U5.46(SH_A)  [project net SH_A_3]
SH_B: C46.1 J17.1 J19.2 Q15.S Q16.S Q21.D Q22.D U5.41(SH_B)  [project net SH_B_3]
SH_C: C49.1 J18.1 J19.1 Q17.S Q18.S Q23.D Q24.D U5.36(SH_C)  [project net SH_C_3]
SL_B: NT10.2 Q21.S Q22.S R45.2 U5.39(SL_B)  [project net SL_B_3]
SL_C: NT11.2 Q23.S Q24.S R46.2 U5.34(SL_C)  [project net SL_C_3]
SN1: NT10.1 R43.1  [project net SN1_3]
SN2: NT11.1 R48.1  [project net SN2_3]
SP1: C51.2 NT4.1 U5.32(SP1)  [project net SP1_3]
SP2: C57.2 NT5.1 U5.30(SP2)  [project net SP2_3]
SPI_MISO: U5.10(SDO) ; port SDO
SPI_MOSI: U5.9(SDI) ; port SDI
SPI_SCK: U5.11(SCLK) ; port SCLK
NetC45_2: C45.2 U5.48(BST_A)
NetC46_2: C46.2 U5.43(BST_B)
NetC48_1: C48.1 U5.14(CP1)
NetC48_2: C48.2 U5.15(CP2)
NetC49_2: C49.2 U5.38(BST_C)
NetC50_2: C50.2 U5.23(DVDD)
NetC51_1: C51.1 R43.2 U5.33(SN1)
NetC52_2: C52.2 U5.27(AVDD)
NetC57_1: C57.1 R48.2 U5.31(SN2)
NetQ13_G: Q13.G Q14.G R36.2
NetQ15_G: Q15.G Q16.G R37.2
NetQ17_G: Q17.G Q18.G R38.2
NetQ19_G: Q19.G Q20.G R40.2
NetQ21_G: Q21.G Q22.G R41.2
NetQ23_G: Q23.G Q24.G R42.2
NetR39_1: R39.1 U5.7(DTC)
NetR44_1: R44.1 U5.25(SO1)
NetR47_1: R47.1 U5.26(SO2)
NetU5_5: U5.5(nOCTW) ; port nOCTW
NetU5_12: U5.12(DC_CAL) ; port DC_CAL

Not connected (* = marked no-connect by the designer): U5 1(RT_CLK) 2(COMP) 3(VSENSE) 4(PWRGD) 50(PH) 51(PH) 52(BST_BK) 53(PVDD2) 54(PVDD2) 56(SS_TR)

### Notes on the sheet
- MOSFETS: NTMFS4935NT1G
- (in symbol NetTie_0.25mm) Net Tie

### Library data of the parts
C43 C47 C50 C52 = GRM188R61C225KE15D: as C23 on sheet MotorCell; Supplier 1: Digi-Key; Supplier Part Number 1: 490-3296-1-ND; Manufacturer Part Number: GRM188R61C225KE15D; RoHS: RoHS Compliant; Category: Capacitors; Stock 1: 1255740; Pricing 1: 1=0.12, 10=0.08, 50=0.046, 100=0.038, 250=0.032, 500=0.0268, 1000=0.022 (USD); Packaging: Cut Tape (CT); Capacitance: 2.2µF; Voltage - Rated: 16V; Temperature Coefficient: X5R; Mounting Type: Surface Mount, MLCC; Operating Temperature: -55°C ~ 85°C; Applications: General Purpose; Ratings: -; Package / Case: 0603 (1608 Metric); Size / Dimension: 0.063" L x 0.031" W (1.60mm x 0.80mm); Height - Seated (Max): -; Thickness (Max): 0.035" (0.90mm); Lead Spacing: -; Features: -; Lead Style: -; ComponentLink1URL: http://www.murata.com/~/media/webrenewal/support/library/catalog/products/capacitor/mlcc/c02e.pdf; ComponentLink1Description: http://www.murata.com/~/media/webrenewal/support/library/catalog/products/capacitor/mlcc/c02e.pdf
C45 C46 C49 C56 = GRM188R71H104KA93D: as C25 on sheet MotorCell; Supplier 1: Digi-Key; Supplier Part Number 1: 490-1519-2-ND; Manufacturer Part Number: GRM188R71H104KA93D; RoHS: RoHS Compliant; Category: Capacitors; Pricing 1: 4000=0.01822, 8000=0.01663, 12000=0.01584 (USD); Packaging: Tape & Reel (TR); Capacitance: 0.1uF; Voltage - Rated: 50V; Temperature Coefficient: X7R; Mounting Type: Surface Mount, MLCC; Operating Temperature: -55°C ~ 125°C; Applications: General Purpose; Ratings: -; Package / Case: 0603 (1608 Metric); Size / Dimension: 0.063" L x 0.032" W (1.60mm x 0.80mm); Height - Seated (Max): -; Thickness (Max): 0.035" (0.90mm); Lead Spacing: -; Features: -; Lead Style: -; ComponentLink1URL: http://www.murata.com/~/media/webrenewal/support/library/catalog/products/capacitor/mlcc/c02e.ashx?la=en-us; ComponentLink1Description: http://www.murata.com/~/media/webrenewal/support/library/catalog/products/capacitor/mlcc/c02e.ashx?la=en-us; Stock: 19812000; Part Status: Active; Supplier 2: Digi-Key; Supplier Part Number 2: 490-1519-1-ND; Pricing 2: 1=0.12, 10=0.084, 100=0.0396, 500=0.02778, 1000=0.023 (USD)
C48 = GRM188R71H223KA01D: as C33 on sheet MotorCell; Supplier 1: Digi-Key; Supplier Part Number 1: 490-1517-2-ND; Manufacturer Part Number: GRM188R71H223KA01D; RoHS: RoHS Compliant; Category: Capacitors; Pricing 1: 4000=0.01518, 8000=0.01386, 12000=0.0132 (USD); Packaging: Tape & Reel (TR); Capacitance: 0.022µF; Voltage - Rated: 50V; Temperature Coefficient: X7R; Mounting Type: Surface Mount, MLCC; Operating Temperature: -55°C ~ 125°C; Applications: General Purpose; Ratings: -; Package / Case: 0603 (1608 Metric); Size / Dimension: 0.063" L x 0.032" W (1.60mm x 0.80mm); Height - Seated (Max): -; Thickness (Max): 0.035" (0.90mm); Lead Spacing: -; Features: -; Lead Style: -; ComponentLink1URL: http://search.murata.co.jp/Ceramy/image/img/A01X/G101/ENG/GRM188R71H223KA01-01.pdf; ComponentLink1Description: http://search.murata.co.jp/Ceramy/image/img/A01X/G101/ENG/GRM188R71H223KA01-01.pdf; Stock: 608000; Part Status: Active; Supplier 2: Digi-Key; Supplier Part Number 2: 490-1517-1-ND; Pricing 2: 1=0.11, 10=0.083, 100=0.0372, 500=0.02656, 1000=0.02087 (USD)
C51 C53 C54 C57 = GRM1885C1H222JA01D: as C36 on sheet MotorCell; Supplier 1: Digi-Key; Supplier Part Number 1: 490-1459-1-ND; RoHS: RoHS Compliant; Category: Capacitors; Stock 1: 850589; Pricing 1: 1=0.11, 10=0.08, 25=0.058, 50=0.0434, 100=0.0355, 250=0.02972, 500=0.02536, 1000=0.01992 (USD); Packaging: Cut Tape (CT); Capacitance: 2200pF; Voltage - Rated: 50V; Mounting Type: Surface Mount, MLCC; Operating Temperature: -55°C ~ 125°C; Applications: General Purpose; Ratings: -; Package / Case: 0603 (1608 Metric); Size / Dimension: 0.063" L x 0.031" W (1.60mm x 0.80mm); Height - Seated (Max): -; Thickness (Max): 0.035" (0.90mm); Lead Spacing: -; Features: -; Lead Style: -; ComponentLink1URL: http://www.murata.com/~/media/webrenewal/support/library/catalog/products/capacitor/mlcc/c02e.ashx; ComponentLink1Description: http://www.murata.com/~/media/webrenewal/support/library/catalog/products/capacitor/mlcc/c02e.ashx; Part Status: Active
J16-J18 = M3 Spade Terminal
J19 = 1704936: as J14 on sheet MotorCell; Supplier 1: Digi-Key; Supplier Part Number 1: 277-5954-ND; RoHS: RoHS Compliant; Category: Connectors, Interconnects; Stock: 3559; Pricing 1: 1=2.19, 10=2.128, 50=1.989, 100=1.8299, 250=1.69064, 500=1.61108, 1000=1.482 (USD); Packaging: Bulk; Part Status: Active; Mounting Type: Through Hole; Features: Interlocking (Side); Color: Green; Operating Temperature: -; Housing Material: Polyamide (PA), Nylon; Contact Material - Plating: -; Clamp Material - Plating: -; Screw Material - Plating: -; ComponentLink1URL: http://media.digikey.com/PDF/Data%20Sheets/Phoenix%20Contact%20PDFs/1704936.pdf; ComponentLink1Description: http://media.digikey.com/PDF/Data%20Sheets/Phoenix%20Contact%20PDFs/1704936.pdf; Manufacturer Part Number: 1704936
NT4 NT5 NT10 NT11 = NetTie_0.25mm
Q13-Q24 = NTMFS4935NT1G: as Q1 on sheet MotorCell; Supplier 1: Digi-Key; Supplier Part Number 1: NTMFS4935NT1GOSCT-ND; RoHS: RoHS Compliant; Category: Discrete Semiconductor Products; Stock 1: 932; Pricing 1: 1=0.61, 10=0.541, 100=0.4145, 500=0.3277 (USD); Packaging: Cut Tape (CT); Part Status: Active; Technology: MOSFET (Metal Oxide); Drain to Source Voltage (Vdss): 30V; FET Feature: -; Operating Temperature: -55°C ~ 150°C (TJ); Mounting Type: Surface Mount; Supplier Device Package: 5-DFN (5x6) (8-SOFL); Package / Case: 8-PowerTDFN, 5 Leads; ComponentLink1URL: http://www.onsemi.com/pub_link/Collateral/NTMFS4935N-D.PDF; ComponentLink1Description: http://www.onsemi.com/pub_link/Collateral/NTMFS4935N-D.PDF; Manufacturer Part Number: NTMFS4935NT1G
R31 = NCP15XH103F03RC: THERMISTOR 10K OHM NTC 0402 SMD; Value: 10k
R35 = RC0603FR-073K3L: as R13 on sheet MotorCell; Supplier 1: Digi-Key; Supplier Part Number 1: 311-3.30KHRCT-ND; Manufacturer Part Number: RC0603FR-073K3L; RoHS: RoHS Compliant; Category: Resistors; Stock 1: 420019; Pricing 1: 1=0.1, 10=0.014, 25=0.01, 100=0.0057, 250=0.00436, 500=0.00348, 1000=0.00257, 2500=0.00223 (USD); Packaging: Cut Tape (CT); Resistance (Ohms): 3.3k; Tolerance: ±1%; Composition: Thick Film; Features: Moisture Resistant; Operating Temperature: -55°C ~ 155°C; Package / Case: 0603 (1608 Metric); Supplier Device Package: 0603; Size / Dimension: 0.063" L x 0.031" W (1.60mm x 0.80mm); Height: 0.022" (0.55mm); Number of Terminations: 2; ComponentLink1URL: http://www.yageo.com/documents/recent/PYu-RC_Group_51_RoHS_L_04.pdf; ComponentLink1Description: http://www.yageo.com/documents/recent/PYu-RC_Group_51_RoHS_L_04.pdf
R36-R38 R40-R42 = RC0603FR-072R2L: as R17 on sheet MotorCell; Supplier 1: Digi-Key; Supplier Part Number 1: 311-2.2HRCT-ND; Manufacturer Part Number: RC0603FR-072R2L; RoHS: RoHS Compliant; Category: Resistors; Stock 1: 16531; Pricing 1: 1=0.1, 10=0.02, 25=0.0144, 100=0.0082, 250=0.00624, 500=0.00498, 1000=0.00367, 2500=0.00319 (USD); Packaging: Cut Tape (CT); Tolerance: ±1%; Composition: Thick Film; Features: Moisture Resistant; Operating Temperature: -55°C ~ 155°C; Package / Case: 0603 (1608 Metric); Supplier Device Package: 0603; Size / Dimension: 0.063" L x 0.031" W (1.60mm x 0.80mm); Height: 0.022" (0.55mm); Number of Terminations: 2; ComponentLink1URL: http://www.yageo.com/documents/recent/PYu-RC_Group_51_RoHS_L_04.pdf; ComponentLink1Description: http://www.yageo.com/documents/recent/PYu-RC_Group_51_RoHS_L_04.pdf
R39 = RC0603FR-0718KL: as R16 on sheet MotorCell; Supplier 1: Digi-Key; Supplier Part Number 1: 311-18.0KHRCT-ND; Manufacturer Part Number: RC0603FR-0718KL; RoHS: RoHS Compliant; Category: Resistors; Stock 1: 0; Pricing 1: 1=0.1, 10=0.014, 25=0.01, 100=0.0057, 250=0.00436, 500=0.00348, 1000=0.00257, 2500=0.00223 (USD); Packaging: Cut Tape (CT); Resistance (Ohms): 18k; Tolerance: ±1%; Composition: Thick Film; Features: Moisture Resistant; Operating Temperature: -55°C ~ 155°C; Package / Case: 0603 (1608 Metric); Supplier Device Package: 0603; Size / Dimension: 0.063" L x 0.031" W (1.60mm x 0.80mm); Height: 0.022" (0.55mm); Number of Terminations: 2; ComponentLink1URL: http://www.yageo.com/documents/recent/PYu-RC_Group_51_RoHS_L_04.pdf; ComponentLink1Description: http://www.yageo.com/documents/recent/PYu-RC_Group_51_RoHS_L_04.pdf
R43 R48 = RC0603FR-07120RL: as R25 on sheet MotorCell; Supplier 1: Digi-Key; Supplier Part Number 1: 311-120HRCT-ND; Manufacturer Part Number: RC0603FR-07120RL; RoHS: RoHS Compliant; Category: Resistors; Stock 1: 1545282; Pricing 1: 1=0.1, 10=0.014, 25=0.01, 100=0.0057, 250=0.00436, 500=0.00348, 1000=0.00257, 2500=0.00223 (USD); Packaging: Cut Tape (CT); Tolerance: ±1%; Composition: Thick Film; Features: Moisture Resistant; Operating Temperature: -55°C ~ 155°C; Package / Case: 0603 (1608 Metric); Supplier Device Package: 0603; Size / Dimension: 0.063" L x 0.031" W (1.60mm x 0.80mm); Height: 0.022" (0.55mm); Number of Terminations: 2; ComponentLink1URL: http://www.yageo.com/documents/recent/PYu-RC_Group_51_RoHS_L_04.pdf; ComponentLink1Description: http://www.yageo.com/documents/recent/PYu-RC_Group_51_RoHS_L_04.pdf
R44 R47 = RC0603FR-0722RL: as R26 on sheet MotorCell; Supplier 1: Digi-Key; Supplier Part Number 1: 311-22.0HRCT-ND; Manufacturer Part Number: RC0603FR-0722RL; RoHS: RoHS Compliant; Category: Resistors; Stock 1: 575303; Pricing 1: 1=0.1, 10=0.014, 25=0.01, 100=0.0057, 250=0.00436, 500=0.00348, 1000=0.00257, 2500=0.00223 (USD); Packaging: Cut Tape (CT); Tolerance: ±1%; Composition: Thick Film; Features: Moisture Resistant; Operating Temperature: -55°C ~ 155°C; Package / Case: 0603 (1608 Metric); Supplier Device Package: 0603; Size / Dimension: 0.063" L x 0.031" W (1.60mm x 0.80mm); Height: 0.022" (0.55mm); Number of Terminations: 2; ComponentLink1URL: http://www.yageo.com/documents/recent/PYu-RC_Group_51_RoHS_L_04.pdf; ComponentLink1Description: http://www.yageo.com/documents/recent/PYu-RC_Group_51_RoHS_L_04.pdf
R45 R46 = CSR2512C0R0005F: as R27 on sheet MotorCell; Value: 500uOhm; Supplier 1: Digi-Key; Supplier Part Number 1: 696-1183-2-ND; RoHS: RoHS Compliant; Category: Resistors; Stock: 2000; Pricing 1: 2000=0.19817, 6000=0.1937, 10000=0.187, 50000=0.18148 (USD); Packaging: Tape & Reel (TR); Part Status: Active; Tolerance: ±1%; Power (Watts): 3W; Composition: Metal Element; Features: Current Sense; Operating Temperature: -55°C ~ 170°C; Package / Case: 2512 (6432 Metric); Supplier Device Package: 2512; Size / Dimension: 0.250" L x 0.118" W (6.35mm x 3.00mm); Height - Seated (Max): 0.057" (1.45mm); Failure Rate: -; ComponentLink1URL: http://riedon.com/media/pdf/CSR.pdf; ComponentLink1Description: http://riedon.com/media/pdf/CSR.pdf; Supplier 2: Digi-Key; Supplier Part Number 2: 696-1183-1-ND; Pricing 2: 1=0.69, 10=0.574, 25=0.4916, 50=0.4426, 100=0.3852, 250=0.3442, 500=0.27864, 1000=0.22536 (USD); Manufacturer Part Number: CSR2512C0R0005F
TP8 TP9 = TESTPOINT: SMD test pin
U5 = DRV8301: MOTOR DRIVER, 3PH, 56HTSSOP

## Sheet AuxHalfH.SchDoc
size A3; SheetNumber: 4
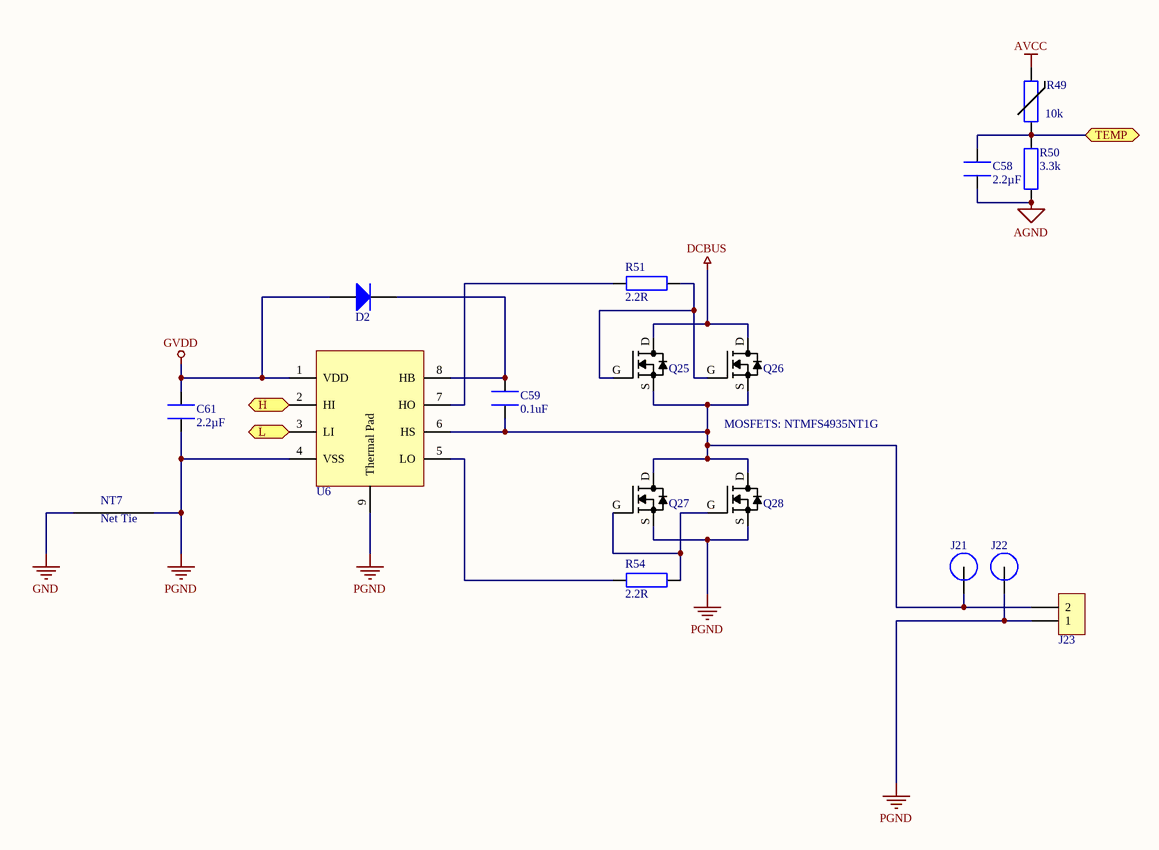
[diagram p3: AuxHalfH.SchDoc]

### Parts
C58  2.2µF  [CAPC1608X09L]
C59  0.1uF  [CAPC1608X09L]
C61  2.2µF  [CAPC1608X09L]
D2  (no value)  [DIOM2717X10N]
J21  (no value)  [M3 Spade Hole]
J22  (no value)  [M3 Spade Hole]
J23  1868076  [1868076]  (value not drawn)
NT7  0.25mm  [NetTie_0.25mm]  (value not drawn)  (net tie, no BOM)
Q25  FILL_FOOTPRINT  [SO8FL_FILL]  (value not drawn)
Q26  (no value)  [SO8FL]
Q27  (no value)  [SO8FL]
Q28  (no value)  [SO8FL]
R49  10k  [RESC1005X40N]
R50  3.3k  [RESC1608X55N]
R51  2.2R  [RESC1608X55N]
R54  2.2R  [RESC1608X55N]
U6  (no value)  [SON80P400X80_HS-9N]

### Ports
H, L, TEMP

### Nets
AGND: C58.1 R50.2
AVCC: R49.2
DCBUS: Q25.D Q26.D
GND: NT7.1
GVDD: C61.2 D2.A U6.1(VDD)
PGND: C61.1 J22.1 J23.1 NT7.2 Q27.S Q28.S U6.4(VSS) U6.9(Thermal_Pad)
AUX_H: U6.2(HI) ; port H
AUX_L: U6.3(LI) ; port L
AUX_TEMP: C58.2 R49.1 R50.1 ; port TEMP
NetC59_1: C59.1 D2.K U6.8(HB)
NetC59_2: C59.2 J21.1 J23.2 Q25.S Q26.S Q27.D Q28.D U6.6(HS)
NetQ25_G: Q25.G Q26.G R51.2
NetQ27_G: Q27.G Q28.G R54.2
NetR51_1: R51.1 U6.7(HO)
NetR54_1: R54.1 U6.5(LO)

### Notes on the sheet
- MOSFETS: NTMFS4935NT1G
- (in symbol NetTie_0.25mm) Net Tie

### Library data of the parts
C58 C61 = GRM188R61C225KE15D: as C23 on sheet MotorCell; Supplier 1: Digi-Key; Supplier Part Number 1: 490-3296-1-ND; Manufacturer Part Number: GRM188R61C225KE15D; RoHS: RoHS Compliant; Category: Capacitors; Stock 1: 1255740; Pricing 1: 1=0.12, 10=0.08, 50=0.046, 100=0.038, 250=0.032, 500=0.0268, 1000=0.022 (USD); Packaging: Cut Tape (CT); Capacitance: 2.2µF; Voltage - Rated: 16V; Temperature Coefficient: X5R; Mounting Type: Surface Mount, MLCC; Operating Temperature: -55°C ~ 85°C; Applications: General Purpose; Ratings: -; Package / Case: 0603 (1608 Metric); Size / Dimension: 0.063" L x 0.031" W (1.60mm x 0.80mm); Height - Seated (Max): -; Thickness (Max): 0.035" (0.90mm); Lead Spacing: -; Features: -; Lead Style: -; ComponentLink1URL: http://www.murata.com/~/media/webrenewal/support/library/catalog/products/capacitor/mlcc/c02e.pdf; ComponentLink1Description: http://www.murata.com/~/media/webrenewal/support/library/catalog/products/capacitor/mlcc/c02e.pdf
C59 = GRM188R71H104KA93D: as C25 on sheet MotorCell; Supplier 1: Digi-Key; Supplier Part Number 1: 490-1519-2-ND; Manufacturer Part Number: GRM188R71H104KA93D; RoHS: RoHS Compliant; Category: Capacitors; Pricing 1: 4000=0.01822, 8000=0.01663, 12000=0.01584 (USD); Packaging: Tape & Reel (TR); Capacitance: 0.1uF; Voltage - Rated: 50V; Temperature Coefficient: X7R; Mounting Type: Surface Mount, MLCC; Operating Temperature: -55°C ~ 125°C; Applications: General Purpose; Ratings: -; Package / Case: 0603 (1608 Metric); Size / Dimension: 0.063" L x 0.032" W (1.60mm x 0.80mm); Height - Seated (Max): -; Thickness (Max): 0.035" (0.90mm); Lead Spacing: -; Features: -; Lead Style: -; ComponentLink1URL: http://www.murata.com/~/media/webrenewal/support/library/catalog/products/capacitor/mlcc/c02e.ashx?la=en-us; ComponentLink1Description: http://www.murata.com/~/media/webrenewal/support/library/catalog/products/capacitor/mlcc/c02e.ashx?la=en-us; Stock: 19812000; Part Status: Active; Supplier 2: Digi-Key; Supplier Part Number 2: 490-1519-1-ND; Pricing 2: 1=0.12, 10=0.084, 100=0.0396, 500=0.02778, 1000=0.023 (USD)
D2 = MBR140SFT1G: as D1 on sheet MotorCell
J21 J22 = M3 Spade Terminal
J23 = 1868076: CONN TERM BLOCK 2POS 7.62MM; Manufacturer: Phoenix Contact; Number of Levels: 1; Positions Per Level: 2; Pitch: 0.300" (7.62mm); Mating Orientation: Horizontal with Board; Current: 30A; Voltage: 300V; Wire Gauge: 10-30 AWG; Wire Termination: Screw - Rising Cage Clamp; Torque - Screw: 0.5-0.6 Nm (4.4-5.3 Lb-In); Screw Thread: M3; Supplier 1: Digi-Key; Supplier Part Number 1: 277-5840-ND; RoHS: RoHS Compliant; Category: Connectors, Interconnects; Stock: 2175; Pricing 1: 1=1.56, 10=1.517, 50=1.4178, 100=1.3044, 250=1.20512, 500=1.14842, 1000=1.0564 (USD); Packaging: Bulk; Part Status: Active; Mounting Type: Through Hole; Features: Interlocking (Side); Color: Green; Operating Temperature: -; Housing Material: Polyamide (PA), Nylon; Contact Material - Plating: -; Clamp Material - Plating: -; Screw Material - Plating: -; ComponentLink1URL: http://media.digikey.com/PDF/Data%20Sheets/Phoenix%20Contact%20PDFs/1868076.pdf; ComponentLink1Description: http://media.digikey.com/PDF/Data%20Sheets/Phoenix%20Contact%20PDFs/1868076.pdf
NT7 = NetTie_0.25mm
Q25-Q28 = NTMFS4935NT1G: as Q1 on sheet MotorCell; Supplier 1: Digi-Key; Supplier Part Number 1: NTMFS4935NT1GOSCT-ND; RoHS: RoHS Compliant; Category: Discrete Semiconductor Products; Stock 1: 932; Pricing 1: 1=0.61, 10=0.541, 100=0.4145, 500=0.3277 (USD); Packaging: Cut Tape (CT); Part Status: Active; Technology: MOSFET (Metal Oxide); Drain to Source Voltage (Vdss): 30V; FET Feature: -; Operating Temperature: -55°C ~ 150°C (TJ); Mounting Type: Surface Mount; Supplier Device Package: 5-DFN (5x6) (8-SOFL); Package / Case: 8-PowerTDFN, 5 Leads; ComponentLink1URL: http://www.onsemi.com/pub_link/Collateral/NTMFS4935N-D.PDF; ComponentLink1Description: http://www.onsemi.com/pub_link/Collateral/NTMFS4935N-D.PDF; Manufacturer Part Number: NTMFS4935NT1G
R49 = NCP15XH103F03RC: THERMISTOR 10K OHM NTC 0402 SMD; Value: 10k
R50 = RC0603FR-073K3L: as R13 on sheet MotorCell; Supplier 1: Digi-Key; Supplier Part Number 1: 311-3.30KHRCT-ND; Manufacturer Part Number: RC0603FR-073K3L; RoHS: RoHS Compliant; Category: Resistors; Stock 1: 420019; Pricing 1: 1=0.1, 10=0.014, 25=0.01, 100=0.0057, 250=0.00436, 500=0.00348, 1000=0.00257, 2500=0.00223 (USD); Packaging: Cut Tape (CT); Resistance (Ohms): 3.3k; Tolerance: ±1%; Composition: Thick Film; Features: Moisture Resistant; Operating Temperature: -55°C ~ 155°C; Package / Case: 0603 (1608 Metric); Supplier Device Package: 0603; Size / Dimension: 0.063" L x 0.031" W (1.60mm x 0.80mm); Height: 0.022" (0.55mm); Number of Terminations: 2; ComponentLink1URL: http://www.yageo.com/documents/recent/PYu-RC_Group_51_RoHS_L_04.pdf; ComponentLink1Description: http://www.yageo.com/documents/recent/PYu-RC_Group_51_RoHS_L_04.pdf
R51 R54 = RC0603FR-072R2L: as R17 on sheet MotorCell; Supplier 1: Digi-Key; Supplier Part Number 1: 311-2.2HRCT-ND; Manufacturer Part Number: RC0603FR-072R2L; RoHS: RoHS Compliant; Category: Resistors; Stock 1: 16531; Pricing 1: 1=0.1, 10=0.02, 25=0.0144, 100=0.0082, 250=0.00624, 500=0.00498, 1000=0.00367, 2500=0.00319 (USD); Packaging: Cut Tape (CT); Tolerance: ±1%; Composition: Thick Film; Features: Moisture Resistant; Operating Temperature: -55°C ~ 155°C; Package / Case: 0603 (1608 Metric); Supplier Device Package: 0603; Size / Dimension: 0.063" L x 0.031" W (1.60mm x 0.80mm); Height: 0.022" (0.55mm); Number of Terminations: 2; ComponentLink1URL: http://www.yageo.com/documents/recent/PYu-RC_Group_51_RoHS_L_04.pdf; ComponentLink1Description: http://www.yageo.com/documents/recent/PYu-RC_Group_51_RoHS_L_04.pdf
U6 = LM5109BSD/NOPB: DRIVER, MOSFET, HALF BRIDGE, WSON-8, 1A; Supplier 1: Farnell; Supplier Part Number 1: 2400642RL; Supplier 2: Farnell; Supplier Part Number 2: 2400642; Supplier 3: Farnell; Supplier Part Number 3: 2382850

## Nets that join several sheets
5V: Top (7 pins), MotorCell (C29.1 L2.2 R16.1)
AGND: Top (9 pins), MotorCell (6 pins), MotorCell_noPow (6 pins), AuxHalfH (C58.1 R50.2)
AVCC: Top (7 pins), MotorCell (R12.2 U4.24), MotorCell_noPow (R31.2 U5.24), AuxHalfH (R49.2)
DCBUS: Top (16 pins), MotorCell (12 pins), MotorCell_noPow (8 pins), AuxHalfH (Q25.D Q26.D)
GND: Top (44 pins), MotorCell (13 pins), MotorCell_noPow (6 pins), AuxHalfH (NT7.1)
GVDD: MotorCell (C32.2 U4.13), MotorCell_noPow (C47.2 U5.13), AuxHalfH (C61.2 D2.A U6.1)
PGND: Top (15 pins), MotorCell (7 pins), MotorCell_noPow (7 pins), AuxHalfH (8 pins)
VCC: Top (27 pins), MotorCell (U4.49), MotorCell_noPow (U5.49)
AUX_H: Top (R59.1 U2.30), AuxHalfH (U6.2)
AUX_L: Top (R60.1 U2.29), AuxHalfH (U6.3)
AUX_TEMP: Top (U2.21), AuxHalfH (C58.2 R49.1 R50.1)
EN_GATE: Top (U2.33), MotorCell (U4.16), MotorCell_noPow (U5.16)
M0_AH: Top (U2.41), MotorCell (U4.17)
M0_AL: Top (U2.34), MotorCell (U4.18)
M0_BH: Top (U2.42), MotorCell (U4.19)
M0_BL: Top (U2.35), MotorCell (U4.20)
M0_CH: Top (U2.43), MotorCell (U4.21)
M0_CL: Top (U2.36), MotorCell (U4.22)
M0_nCS: Top (U2.2), MotorCell (U4.8)
M0_SO1: Top (U2.8), MotorCell (C38.1 R26.2 TP6.1)
M0_SO2: Top (U2.9), MotorCell (C39.1 R29.2 TP7.1)
M0_TEMP: Top (U2.25), MotorCell (C23.2 R12.1 R13.1)
M1_AH: Top (U2.37), MotorCell_noPow (U5.17)
M1_AL: Top (U2.23), MotorCell_noPow (U5.18)
M1_BH: Top (U2.38), MotorCell_noPow (U5.19)
M1_BL: Top (U2.26), MotorCell_noPow (U5.20)
M1_CH: Top (U2.39), MotorCell_noPow (U5.21)
M1_CL: Top (U2.27), MotorCell_noPow (U5.22)
M1_nCS: Top (U2.3), MotorCell_noPow (U5.8)
M1_SO1: Top (U2.11), MotorCell_noPow (C53.1 R44.2 TP8.1)
M1_SO2: Top (U2.10), MotorCell_noPow (C54.1 R47.2 TP9.1)
M1_TEMP: Top (U2.20), MotorCell_noPow (C43.2 R31.1 R35.1)
nFAULT: Top (U2.54), MotorCell (U4.6), MotorCell_noPow (U5.6)
SPI_MISO: Top (J3.9 U2.52), MotorCell (U4.10), MotorCell_noPow (U5.10)
SPI_MOSI: Top (J3.10 U2.53), MotorCell (U4.9), MotorCell_noPow (U5.9)
SPI_SCK: Top (J3.8 U2.51), MotorCell (U4.11), MotorCell_noPow (U5.11)

## Assembly variants
48V: alternate parts C11 -> EEH-ZC1H121P, C12 -> EEH-ZC1H121P, C17 -> EEH-ZC1H121P, C16 -> EEH-ZC1H121P, C15 -> EEH-ZC1H121P, C14 -> EEH-ZC1H121P, C18 -> EEH-ZC1H121P, C13 -> EEH-ZC1H121P, C19 -> GRM21BR61H475KE51L, C21 -> GRM21BR61H475KE51L, C26 -> GRM21BR61H475KE51L, C55 -> GRM21BR61H475KE51L, C40 -> GRM21BR61H475KE51L, C60 -> GRM21BR61H475KE51L, C44 -> GRM21BR61H475KE51L, C20 -> GRM21BR61H475KE51L, Q25 -> NTMFS5C628NLT, Q1 -> NTMFS5C628NLT, Q2 -> NTMFS5C628NLT, Q3 -> NTMFS5C628NLT, Q4 -> NTMFS5C628NLT, Q5 -> NTMFS5C628NLT, Q6 -> NTMFS5C628NLT, Q7 -> NTMFS5C628NLT, Q8 -> NTMFS5C628NLT, Q9 -> NTMFS5C628NLT, Q10 -> NTMFS5C628NLT, Q11 -> NTMFS5C628NLT, Q12 -> NTMFS5C628NLT, Q13 -> NTMFS5C628NLT, Q14 -> NTMFS5C628NLT, Q15 -> NTMFS5C628NLT, Q16 -> NTMFS5C628NLT, Q17 -> NTMFS5C628NLT, Q18 -> NTMFS5C628NLT, Q19 -> NTMFS5C628NLT, Q20 -> NTMFS5C628NLT, Q21 -> NTMFS5C628NLT, Q22 -> NTMFS5C628NLT, Q23 -> NTMFS5C628NLT, Q24 -> NTMFS5C628NLT, Q26 -> NTMFS5C628NLT, Q27 -> NTMFS5C628NLT, Q28 -> NTMFS5C628NLT, R6 -> RC0603FR-0718KL